# EAGLE design BSB-to-UEXT (EAGLE 6.6.0)
REVISION: v1.0
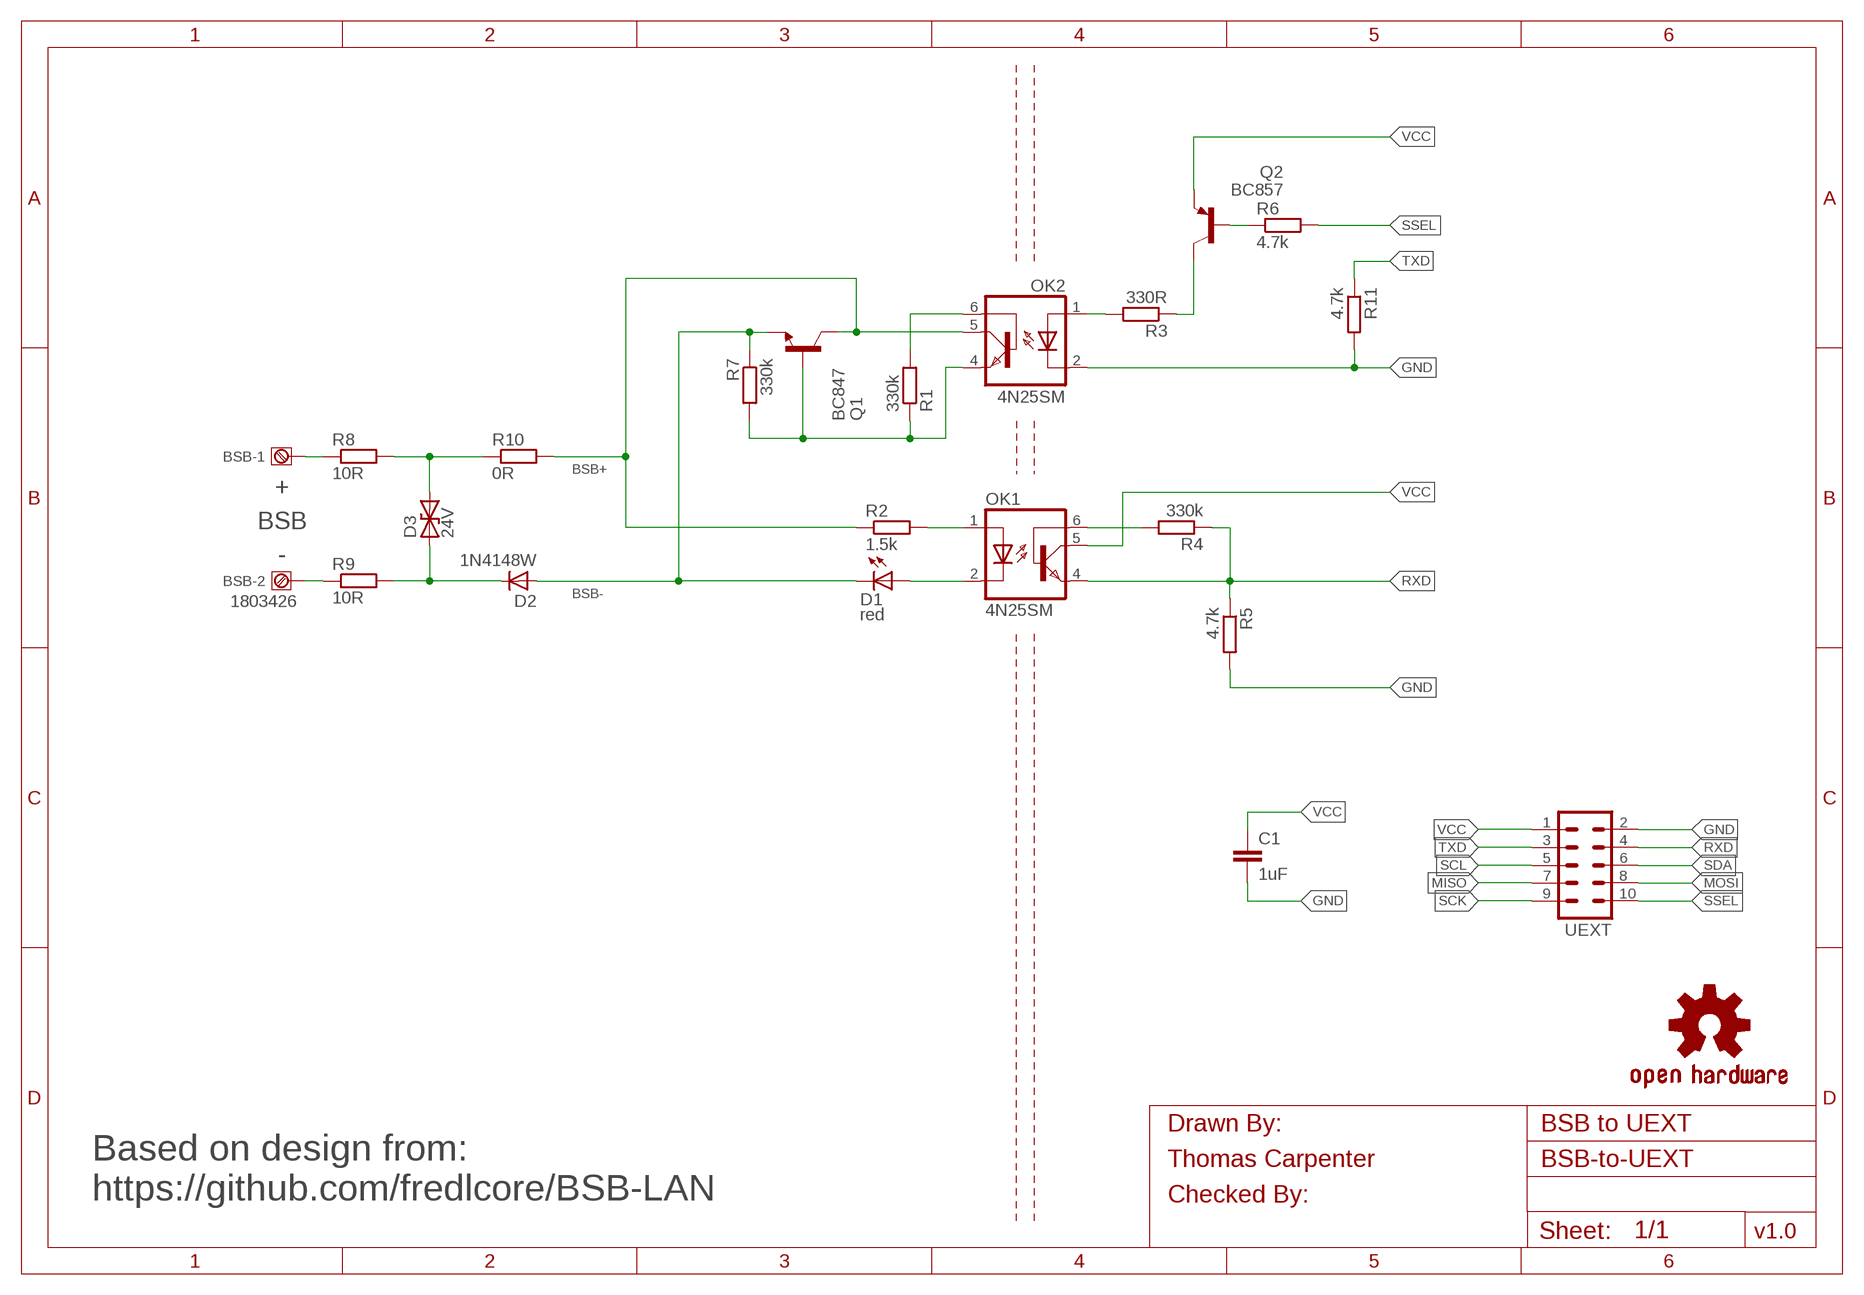
[diagram p0: schematic, sheet 1]
FRAME1 (A4L-LOC): DRAWN_BY: Thomas Carpenter; SHEET_NAME: BSB to UEXT

## Parts
BSB  1803426  [1803426]
C1  1uF  C-EUC0805  [C0805]
D1  red  LEDCHIPLED_0805  [CHIPLED_0805]
D2  1N4148W  DIODE-SOD123  [SOD123]
D3  24V  TVS-BIDIRSMB  [SMBG]
OK1  4N25SM  [DIL6-SMD]
OK2  4N25SM  [DIL6-SMD]
Q1  BC847  [SOT23]
Q2  BC857  [SOT23-BEC]
R1  330k  R-EU_R0805  [R0805]
R2  1.5k  R-EU_R0805  [R0805]
R3  330R  R-EU_R0805  [R0805]
R4  330k  R-EU_R0805  [R0805]
R5  4.7k  R-EU_R0805  [R0805]
R6  4.7k  R-EU_R0805  [R0805]
R7  330k  R-EU_R0805  [R0805]
R8  10R  R-EU_R1206  [R1206]
R9  10R  R-EU_R1206  [R1206]
R10  0R  R-EU_R1206L  [R1206L]
R11  4.7k  R-EU_R0805  [R0805]
U$3  DNI  OSHW-LOGOM  [OSHW-LOGO-M]
UEXT  ML10F  [ML10F]

## Nets
BSB+: OK2.5(COL) Q1.3(C) R2.1 R10.2
BSB-: D1.C D2.A Q1.2(E) R7.1
BSB-RX-A: OK1.1(A) R2.2
BSB-RX-K: D1.A OK1.2(C)
BSB-TX-B: OK2.6(BAS) R1.2
BSB-TX-E: OK2.4(EMI) Q1.1(B) R1.1 R7.2
CON-BSB+: BSB.1 R8.1
CON-BSB-: BSB.2 R9.1
GND: C1.2 OK2.2(C) R5.2 R11.2 UEXT.2
MISO: UEXT.7
MOSI: UEXT.8
RXD: OK1.4(EMI) R4.1 R5.1 UEXT.4
RXD-B: OK1.6(BAS) R4.2
SCK: UEXT.9
SCL: UEXT.5
SDA: UEXT.6
SSEL: R6.2 UEXT.10
TVS-BSB+: D3.2 R8.2 R10.1
TVS-BSB-: D2.C D3.1 R9.2
TXD: R11.1 UEXT.3
TXD-A: OK2.1(A) R3.2
TXD-B: Q2.B R6.1
TXD-C: Q2.C R3.1
VCC: C1.1 OK1.5(COL) Q2.E UEXT.1

## Notes on the sheet
- +
  BSB
  -
- Based on design from:
  https://github.com/fredlcore/BSB-LAN

## Library data of the parts
BSB = BSB-LAN:1803426; LCSC_PART: C480514
C1 = BSB-LAN:C-EU: CAPACITOR, European symbol; LCSC_PART: C28323
D1 = BSB-LAN:LED: LED OSRAM: - CHIPLED LG R971, LG N971, LY N971, LG Q971, LY Q971, LO R971, LY R971 LH N974, LH R974 LS Q976, LO Q976, LY Q976 LO Q996 - Hyper CHIPLED LW Q18S LB Q993, LB Q99A, LB R99A - SideLED LS A670, LO A670, LY A670, LG A670, LP A670 LB A673, LV A673, LT A673, LW A673 LH A674 LY A675 LS A676, LA A676, LO A676, LY A676, LW A676 LS A679, LY A679, LG A679 - Hyper Micro SIDELED® LS Y876, LA Y876, LO Y876, LY Y876 LT Y87S - SmartLED LW L88C, LW L88S LB L89C, LB L89S, LG L890 LS L89K, LO L89K, LY L89K LS L896, LA L896, LO L896, LY L896 - TOPLED LS T670, LO T670, LY T670, LG T670, LP T670 LSG T670, LSP T670, LSY T670, LOP T670, LYG T670 LG T671, LOG T671, LSG T671 LB T673, LV T673, LT T673, LW T673 LH T674 LS T676, LA T676, LO T676, LY T676, LB T676, LH T676, LSB T676, LW T676 LB T67C, LV T67C, LT T67C, LS T67K, LO T67K, LY T67K, LW E67C LS E67B, LA E67B, LO E67B, LY E67B, LB E67C, LV E67C, LT E67C LW T67C LS T679, LY T679, LG T679 LS T770, LO T770, LY T770, LG T770, LP T770 LB T773, LV T773, LT T773, LW T773 LH T774 LS E675, LA E675, LY E675, LS T675 LS T776, LA T776, LO T776, LY T776, LB T776 LHGB T686 LT T68C, LB T68C - Hyper Mini TOPLED® LB M676 - Mini TOPLED Santana® LG M470 LS M47K, LO M47K, LY M47K Source: http://www.osram.convergy.de LUXEON: - LUMILED® LXK2-PW12-R00, LXK2-PW12-S00, LXK2-PW14-U00, LXK2-PW14-V00 LXK2-PM12-R00, LXK2-PM12-S00, LXK2-PM14-U00 LXK2-PE12-Q00, LXK2-PE12-R00, LXK2-PE12-S00, LXK2-PE14-T00, LXK2-PE14-U00 LXK2-PB12-K00, LXK2-PB12-L00, LXK2-PB12-M00, LXK2-PB14-N00, LXK2-PB14-P00, LXK2-PB14-Q00 LXK2-PR12-L00, LXK2-PR12-M00, LXK2-PR14-Q00, LXK2-PR14-R00 LXK2-PD12-Q00, LXK2-PD12-R00, LXK2-PD12-S00 LXK2-PH12-R00, LXK2-PH12-S00 LXK2-PL12-P00, LXK2-PL12-Q00, LXK2-PL12-R00 Source: www.luxeon.com KINGBRIGHT: KA-3528ASYC Source: www.kingbright.com; JLC_ROT: 270; LCSC_PART: C84256
D2 = BSB-LAN:DIODE-: DIODE; LCSC_PART: C81598
D3 = BSB-LAN:TVS-BIDIR: Bidirectional TVS Suppressor Diode SMAJxx(C)A Voltage Suppressor - SMA Package (DO-214AC) SMBJxx(C)A Voltage Suppressor - SMB Package (DO-214AA) SMCJxx(C)A Voltage Suppressor - SMC Package (DO-214AB); LCSC_PART: C83268
OK1 OK2 = BSB-LAN:4N*?M: General Purpose 6-Pin Phototransistor Optocouplers Source: http://www.fairchildsemi.com/ds/4N/4N35-M.pdf; LCSC_PART: C258246
Q1 = BSB-LAN:BC847*: NPN Transistor; JLC_ROT: 270; LCSC_PART: C130417
Q2 = BSB-LAN:BC857*: PNP Transistror; JLC_ROT: 270; LCSC_PART: C426782
R1 R4 R7 = BSB-LAN:R-EU_: RESISTOR, European symbol; LCSC_PART: C17629
R2 = BSB-LAN:R-EU_: RESISTOR, European symbol; LCSC_PART: C4310
R3 = BSB-LAN:R-EU_: RESISTOR, European symbol; LCSC_PART: C17630
R5 R6 R11 = BSB-LAN:R-EU_: RESISTOR, European symbol; LCSC_PART: C17673
R8 R9 = BSB-LAN:R-EU_: RESISTOR, European symbol; LCSC_PART: C17903
R10 = BSB-LAN:R-EU_: RESISTOR, European symbol; LCSC_PART: C17888
U$3 = BSB-LAN:OSHW-LOGO: Open Source Hardware Logo This logo indicates the piece of hardware it is found on incorporates a OSHW license and/or adheres to the definition of open source hardware found here: http://freedomdefined.org/OSHW
UEXT = BSB-LAN:ML10: HARTING

## Board
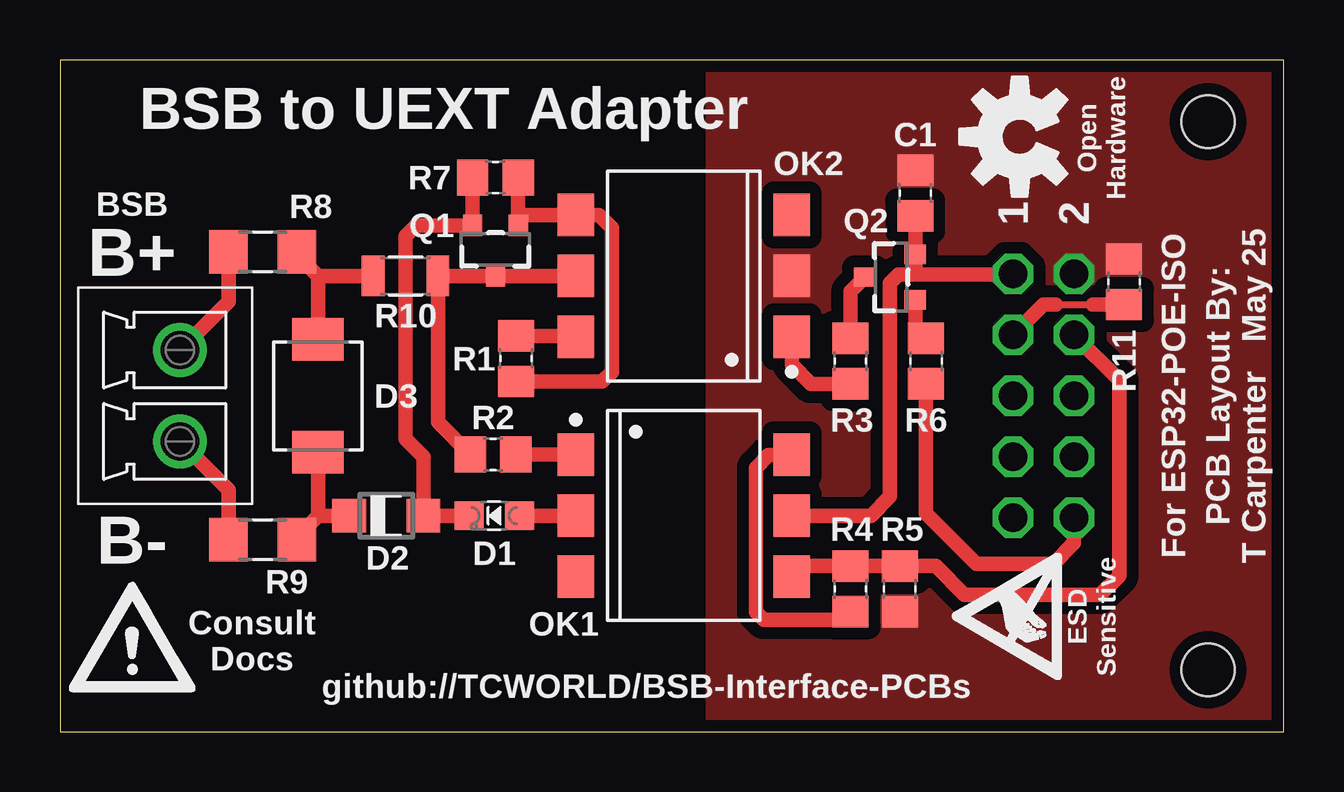
[diagram p1: board, top side]
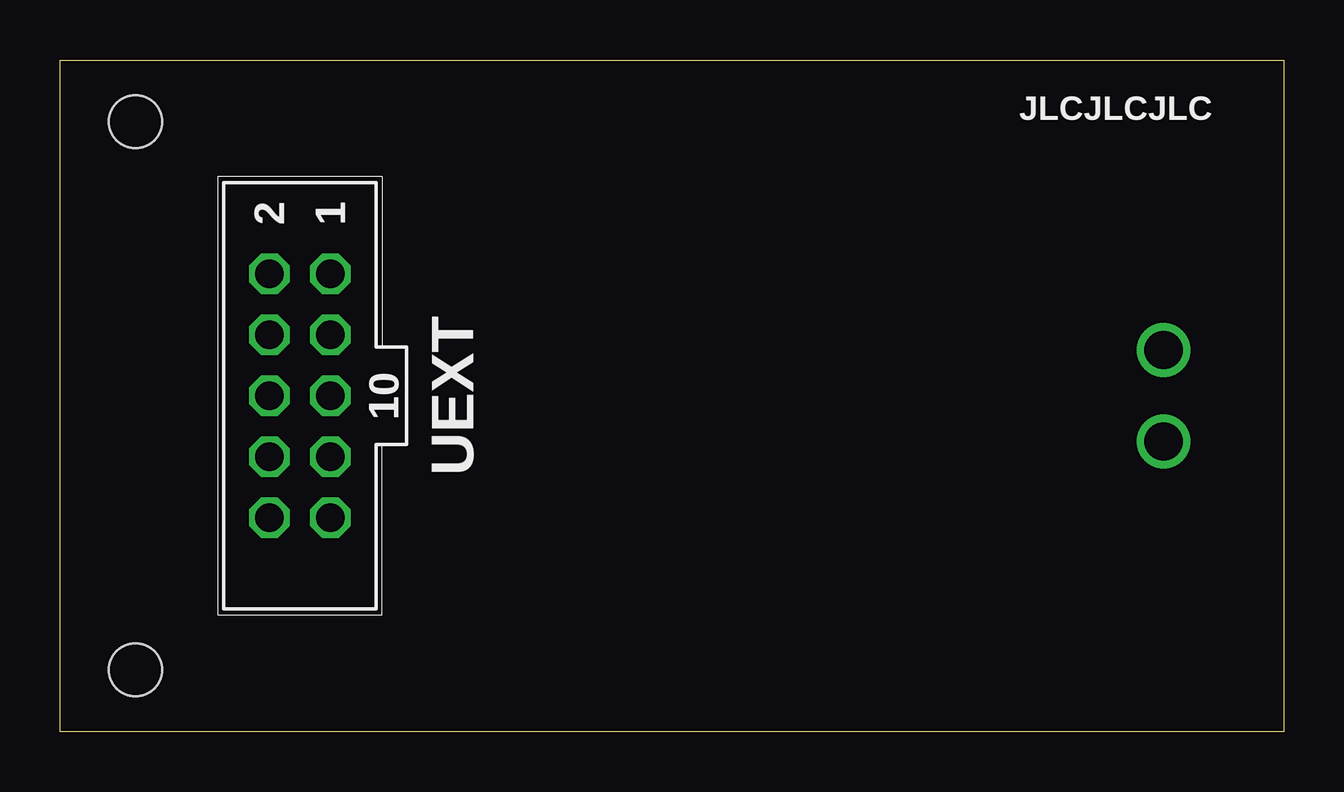
[diagram p2: board, bottom side, seen from below]

Size 51 x 28 mm. Coordinates in mm from the lower left corner, seen from the top.
Outline: 0,0 51,0 51,28 0,28 0,0
Copper layers (1*16): Top 0.035mm / dielectric 1.5mm / Bottom 0.035mm
Design rules "jlc2l": minimum track width 0.15mm, minimum drill 0.2mm, track to track 0.15mm, track to pad 0.15mm, pad to pad 0.15mm, via to via 0.15mm, smd to smd 0mil, copper to edge 0.25mm, drill to drill 0.3mm, minimum pad ring 0.15mm, minimum via ring 0.15mm, stop-mask expansion 0.125mm, vias tented up to drill 1mm, thermal gap 6mil
Holes 2.2 mm at 47.86,25.43 47.86,2.57

### Footprints (pad centres in the part's own frame; a part is rotated, then mirrored left to right if it is on the bottom)
1803426 = drill 1.6: 1 0,1.905; 2 0,-1.905
C0805 = smd 1.3 x 1.5: 1 -0.95,0; 2 0.95,0
CHIPLED_0805 = smd 1.2 x 1.2: A 0,-1.05; C 0,1.05
SOD123 = smd 1.4 x 1.4: A 1.55,0; C -1.55,0
SMBG = smd 1.78 x 2.16: 1 -2.35,0; 2 2.35,0
DIL6-SMD = smd 1.78 x 1.52: 1 -2.54,-4.5; 2 0,-4.5; 3 2.54,-4.5; 4 2.54,4.5; 5 0,4.5; 6 -2.54,4.5
SOT23 = smd 0.8 x 0.9: 1 -0.95,-1; 2 0.95,-1; 3 0,1.1
SOT23-BEC = smd 0.8 x 0.9: B -0.95,-1; C 0,1.1; E 0.95,-1
R0805 = smd 1.3 x 1.5: 1 -0.95,0; 2 0.95,0
R1206 = smd 1.6 x 1.803: 1 -1.422,0; 2 1.422,0
R1206L = smd 0.95 x 1.7: 1 -1.35,0; 2 1.35,0
ML10F = drill 1.2 octagon: 1 -5.08,1.27; 2 -5.08,-1.27; 3 -2.54,1.27; 4 -2.54,-1.27; 5 0,1.27; 6 0,-1.27; 7 2.54,1.27; 8 2.54,-1.27; 9 5.08,1.27; 10 5.08,-1.27

### Placement (x,y rotation side)
BSB  5,14 0 top
C1  35.65,22.45 90 top
D1  18.1,9 90 top
D2  13.6,9 0 top
D3  10.75,14 90 top
OK1  26,9 270 top
OK2  26,19 90 top
Q1  18.15,20.1 180 top
Q2  34.65,18.95 90 top
R1  19.01,15.55 90 top
R2  18.05,11.55 0 top
R3  32.95,15.45 270 top
R4  32.95,5.95 270 top
R5  35,5.95 270 top
R6  36.1,15.45 270 top
R7  18.15,23.1 0 top
R8  8.45,20 0 top
R9  8.45,8 0 top
R10  14.4,19 0 top
R11  44.35,18.75 90 top
U$1  [WARN-TINY]  3,3.4 0 top
U$2  [ESD-TINY]  40,4.8 90 top
U$3  40,24.8 90 top
UEXT  41,14 270 bottom

### Tracks (layer width: path | path; a pad name or v marks a point on that pad's centre or on a via)
BSB+
  Top 0.6: R2.1 15.75,12.9 R10.2 Q1.3 OK2.5
BSB-
  Top 0.6: D1.C D2.A 15.15,11.45 14.4,12.2 14.4,20.65 14.85,21.1 Q1.2 R7.1
BSB-RX-A
  Top 0.6: R2.2 OK1.1
BSB-RX-K
  Top 0.6: D1.A OK1.2
BSB-TX-B
  Top 0.6: R1.2 21.5,16.5 OK2.6
BSB-TX-E
  Top 0.6: 19.1,21.54 R7.2 | Q1.1 19.1,21.54 | 19.1,21.54 OK2.4 22.46,21.54 23,21 23,15 22.6,14.6 R1.1
CON-BSB+
  Top 0.6: BSB.1 7.03,17.93 R8.1
CON-BSB-
  Top 0.6: BSB.2 7.03,10.07 R9.1
GND
  pour Top (isolate 0.5, rank 6, no thermals): 27,28 27,0 51,0 51,28
RXD
  Top 0.6: OK1.4 30.5,6.9 R4.1 R5.1 36.5,6.9 37.7,5.7 43.35,5.7 44.15,6.5 44.15,14.66 UEXT.4
RXD-B
  Top 0.6: R4.2 32.95,4.65 29.35,4.65 29,5 29,11 29.54,11.54 OK1.6
SSEL
  Top 0.6: R6.2 36.1,9.1 38.2,7 41.4,7 42.27,7.87 UEXT.10
TVS-BSB+
  Top 0.6: D3.2 10.75,19 | R8.2 9.87,19.88 10.75,19 | 10.75,19 R10.1
TVS-BSB-
  Top 0.6: D2.C 10.75,9 | D3.1 10.75,9 | 10.75,9 9.87,8.12 R9.2
TXD
  Top 0.3: 41.5,17.8 43.05,17.8
  Top 0.6: UEXT.3 40.99,17.8 41.5,17.8 | 43.05,17.8 R11.1
TXD-A
  Top 0.6: OK2.1 30.5,15.3 31.3,14.5 R3.2
TXD-B
  Top 0.6: Q2.B 35.65,16.4 R6.1
TXD-C
  Top 0.6: Q2.C 32.95,18.35 R3.1
VCC
  Top 0.6: 35.65,19.05 34.95,19.05 34.6,18.7 34.6,9.8 33.8,9 OK1.5 | C1.1 Q2.E 35.65,19.05 | UEXT.1 39.73,19.05 35.65,19.05

### Text on the board
tPlace: BSB to UEXT Adapter | Open / Hardware | B+ | For ESP32-POE-ISO | PCB Layout By: / T Carpenter May 25 | B- | Consult / Docs | github://TCWORLD/BSB-Interface-PCBs
bPlace: JLCJLCJLC